# EAGLE design MAX2871 (EAGLE 9.3.1)
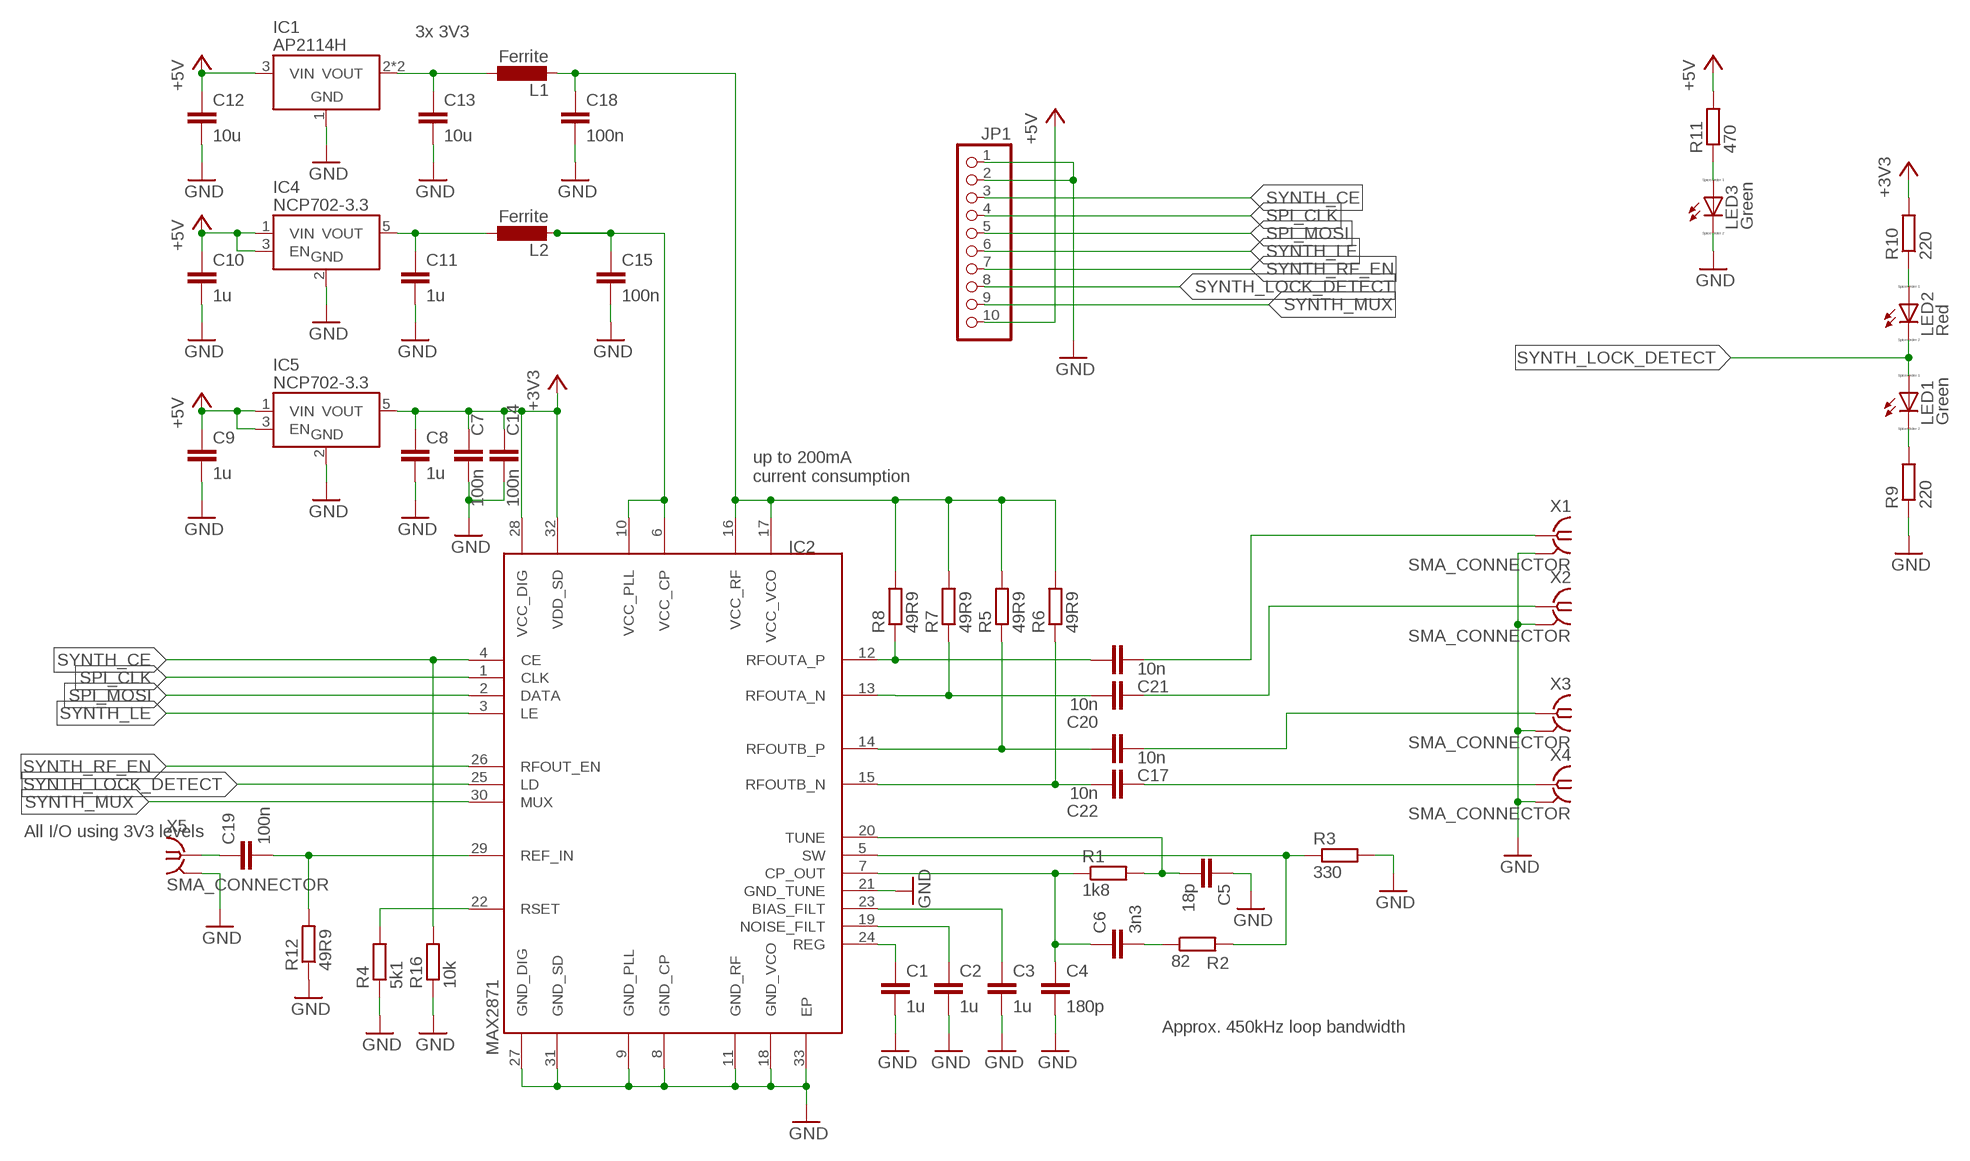
[diagram p0: schematic, sheet 1]

## Parts
C1  1u  C-EUC0603  [C0603]
C2  1u  C-EUC0603  [C0603]
C3  1u  C-EUC0603  [C0603]
C4  180p  C-EUC0603  [C0603]
C5  18p  C-EUC0603  [C0603]
C6  3n3  C-EUC0603  [C0603]
C7  100n  C-EUC0603  [C0603]
C8  1u  C-EUC0603  [C0603]
C9  1u  C-EUC0603  [C0603]
C10  1u  C-EUC0603  [C0603]
C11  1u  C-EUC0603  [C0603]
C12  10u  C-EUC1206  [C1206]
C13  10u  C-EUC1206  [C1206]
C14  100n  C-EUC0603  [C0603]
C15  100n  C-EUC0603  [C0603]
C17  10n  C-EUC0603  [C0603]
C18  100n  C-EUC0603  [C0603]
C19  100n  C-EUC0603  [C0603]
C20  10n  C-EUC0603  [C0603]
C21  10n  C-EUC0603  [C0603]
C22  10n  C-EUC0603  [C0603]
IC1  AP2114H  [SOT230P700X180-4]
IC2  MAX2871  [QFN50P500X500X80-33T310]
IC4  NCP702-3.3  NCP702  [SOT95P240X110-5]
IC5  NCP702-3.3  NCP702  [SOT95P240X110-5]
JP1  PINHD-1X10/90  [1X10/90]
L1  Ferrite  INDUCTOR0603  [R0603]
L2  Ferrite  INDUCTOR0603  [R0603]
LED1  Green  LED_ESML0603  [LED_SML0603]
LED2  Red  LED_ESML0603  [LED_SML0603]
LED3  Green  LED_ESML0603  [LED_SML0603]
R1  1k8  R-EU_R0603  [R0603]
R2  82  R-EU_R0603  [R0603]
R3  330  R-EU_R0603  [R0603]
R4  5k1  R-EU_R0603  [R0603]
R5  49R9  R-EU_R0603  [R0603]
R6  49R9  R-EU_R0603  [R0603]
R7  49R9  R-EU_R0603  [R0603]
R8  49R9  R-EU_R0603  [R0603]
R9  220  R-EU_R0603  [R0603]
R10  220  R-EU_R0603  [R0603]
R11  470  R-EU_R0603  [R0603]
R12  49R9  R-EU_R0603  [R0603]
R16  10k  R-EU_R0603  [R0603]
X1  SMA_CONNECTOR  [J502-ND-142-0711-821/826]
X2  SMA_CONNECTOR  [J502-ND-142-0711-821/826]
X3  SMA_CONNECTOR  [J502-ND-142-0711-821/826]
X4  SMA_CONNECTOR  [J502-ND-142-0711-821/826]
X5  SMA_CONNECTOR  [J502-ND-142-0711-821/826]

## Nets
10MHZ_REF: C19.1 X5.1
+3V3: C7.1 C8.1 C14.1 IC2.28(VCC_DIG) IC2.32(VDD_SD) IC5.5(VOUT) R10.2
+5V: C9.1 C10.1 C12.1 IC1.3(VIN) IC4.1(VIN) IC4.3(EN) IC5.1(VIN) IC5.3(EN) JP1.10 R11.2
GND: C1.2 C2.2 C3.2 C4.2 C5.1 C7.2 C8.2 C9.2 C10.2 C11.2 C12.2 C13.2 C14.2 C15.2 C18.2 IC1.1(GND) IC2.8(GND_CP) IC2.9(GND_PLL) IC2.11(GND_RF) IC2.18(GND_VCO) IC2.21(GND_TUNE) IC2.27(GND_DIG) IC2.31(GND_SD) IC2.33(EP) IC4.2(GND) IC5.2(GND) JP1.1 JP1.2 LED3.C R3.2 R4.1 R9.1 R12.1 R16.1 X1.G@1 X1.G@2 X1.G@3 X1.G@4 X2.G@1 X2.G@2 X2.G@3 X2.G@4 X3.G@1 X3.G@2 X3.G@3 X3.G@4 X4.G@1 X4.G@2 X4.G@3 X4.G@4 X5.G@1 X5.G@2 X5.G@3 X5.G@4
N$1: C5.2 IC2.20(TUNE) R1.2
N$2: C4.1 C6.1 IC2.7(CP_OUT) R1.1
N$3: C1.1 IC2.24(REG)
N$4: C2.1 IC2.19(NOISE_FILT)
N$5: C3.1 IC2.23(BIAS_FILT)
N$6: C6.2 R2.1
N$7: IC2.5(SW) R2.2 R3.1
N$8: IC2.22(RSET) R4.2
N$9: C19.2 IC2.29(REF_IN) R12.2
N$10: C18.1 IC2.16(VCC_RF) IC2.17(VCC_VCO) L1.2 R5.2 R6.2 R7.2 R8.2
N$11: C15.1 IC2.6(VCC_CP) IC2.10(VCC_PLL) L2.2
N$12: C22.2 IC2.15(RFOUTB_N) R6.1
N$13: LED3.A R11.1
N$14: C21.1 IC2.12(RFOUTA_P) R8.1
N$15: C20.2 IC2.13(RFOUTA_N) R7.1
N$16: C17.1 IC2.14(RFOUTB_P) R5.1
N$17: C21.2 X1.1
N$18: C20.1 X2.1
N$19: C17.2 X3.1
N$20: C22.1 X4.1
N$21: LED1.C R9.2
N$22: LED2.A R10.1
N$23: C13.1 IC1.2(VOUT) IC1.4(VOUT) L1.1
N$24: C11.1 IC4.5(VOUT) L2.1
SPI_CLK: IC2.1(CLK) JP1.4
SPI_MOSI: IC2.2(DATA) JP1.5
SYNTH_CE: IC2.4(CE) JP1.3 R16.2
SYNTH_LE: IC2.3(LE) JP1.6
SYNTH_LOCK_DETECT: IC2.25(LD) JP1.8 LED1.A LED2.C
SYNTH_MUX: IC2.30(MUX) JP1.9
SYNTH_RF_EN: IC2.26(RFOUT_EN) JP1.7

## Notes on the sheet
- 3x 3V3
- up to 200mA
  current consumption
- All I/O using 3V3 levels
- Approx. 450kHz loop bandwidth

## Library data of the parts
C1-C15 C17-C22 = rcl:C-EU: CAPACITOR, European symbol
IC1 = rf:AP2114
IC2 = rf:MAX2871
IC4 IC5 = rf:NCP702
JP1 = pinhead:PINHD-1X10: PIN HEADER
L1 L2 = rf:INDUCTOR
LED1-LED3 = eagle-ltspice:LED_E: LED Source: http://www.osram.convergy.de Source: www.luxeon.com Source: www.kingbright.com; SPICEMODEL: NONE; SPICEPREFIX: D; SPICETYPE: diode
R1-R12 R16 = resistor:R-EU_: RESISTOR, European symbol
X1-X5 = rf:SMA_CONNECTOR

## Board
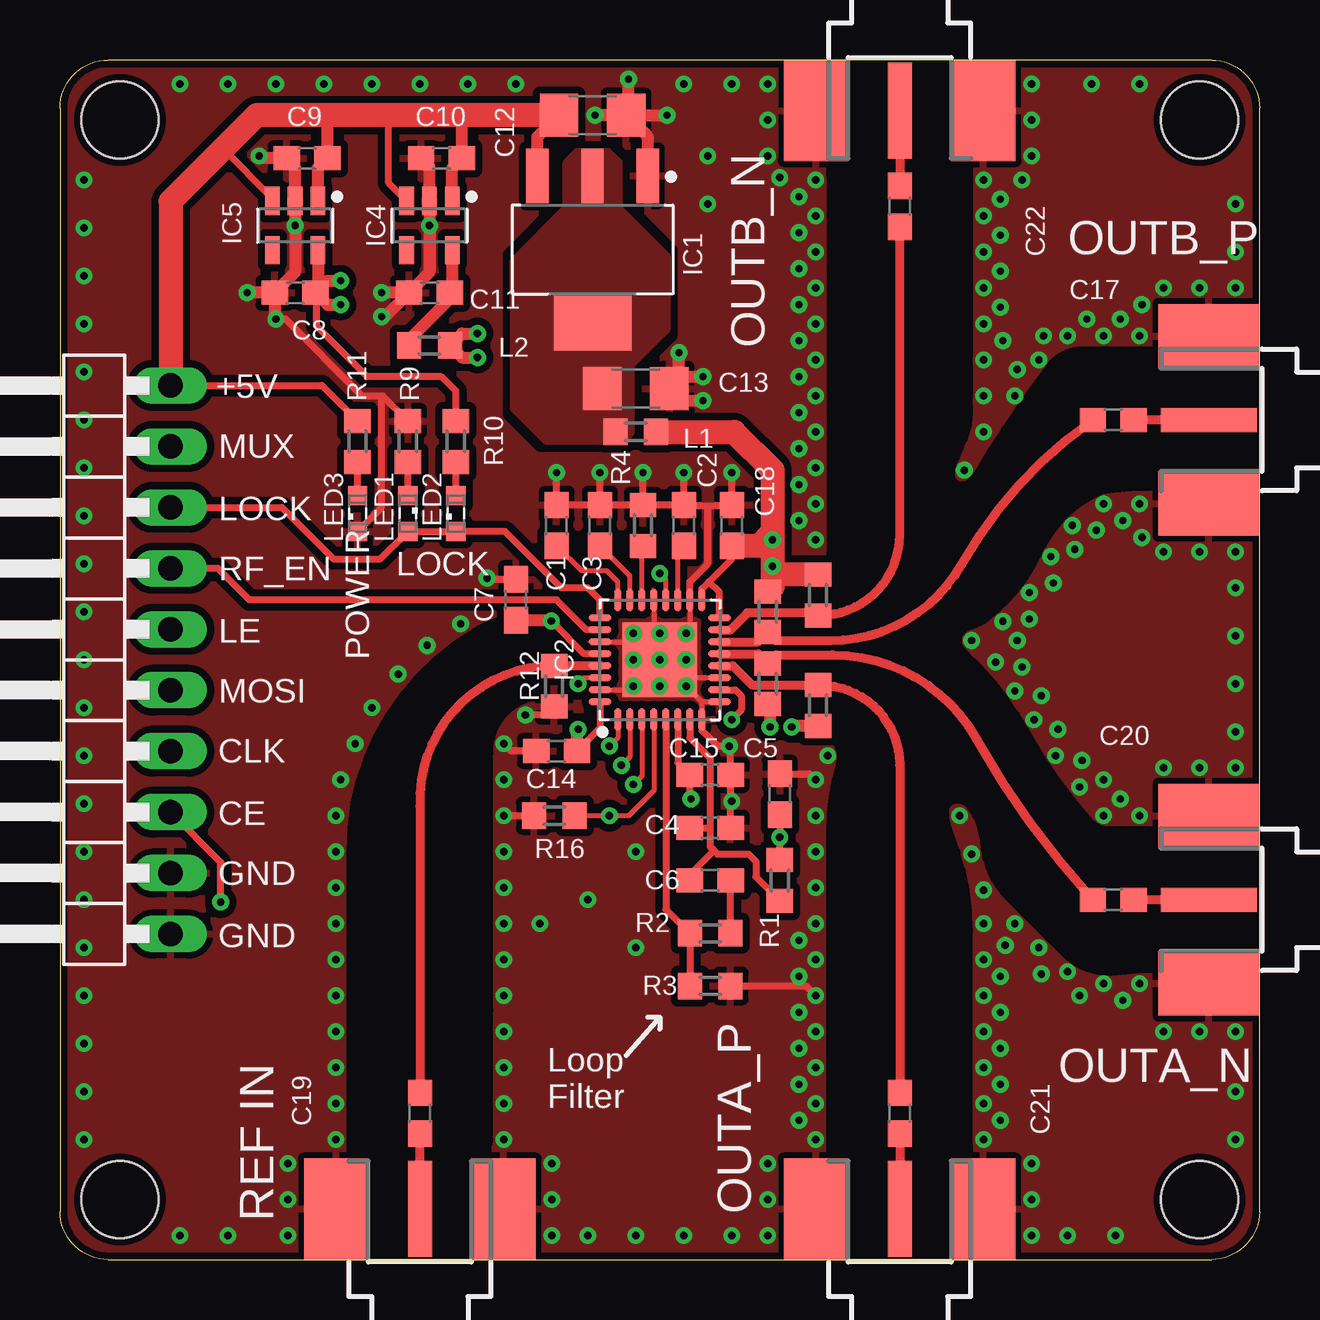
[diagram p1: board, top side]
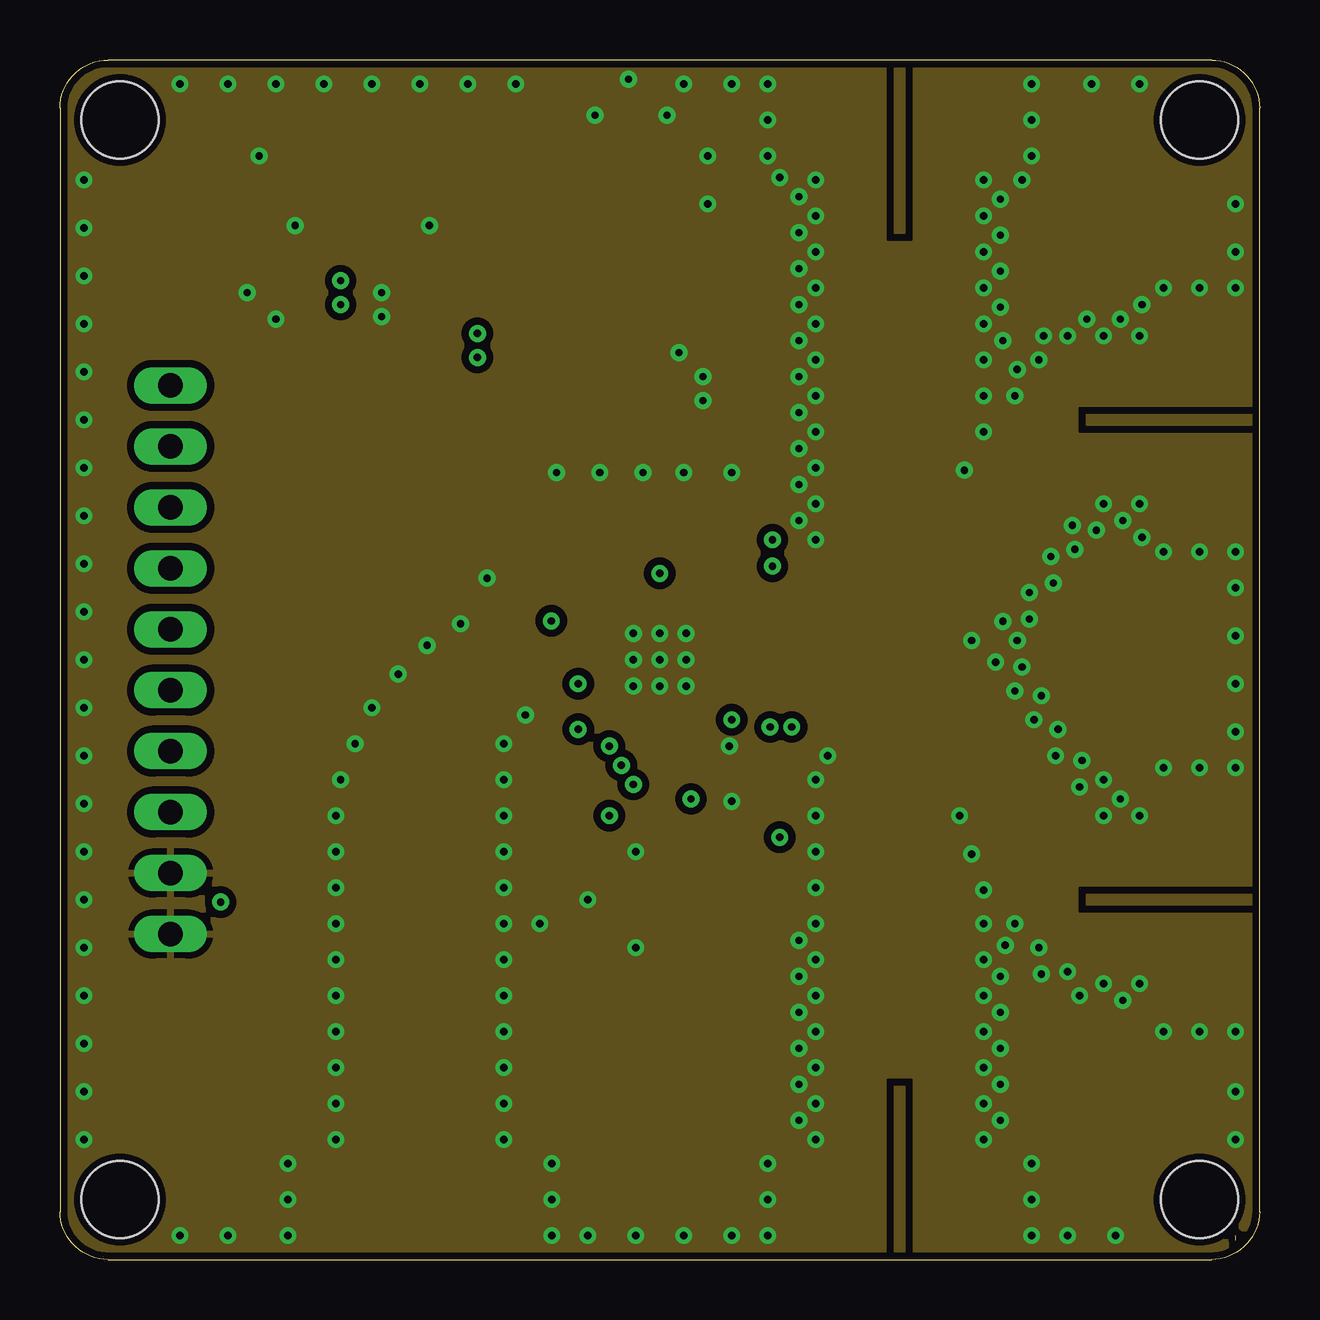
[diagram p2: board, inner layer Route2]
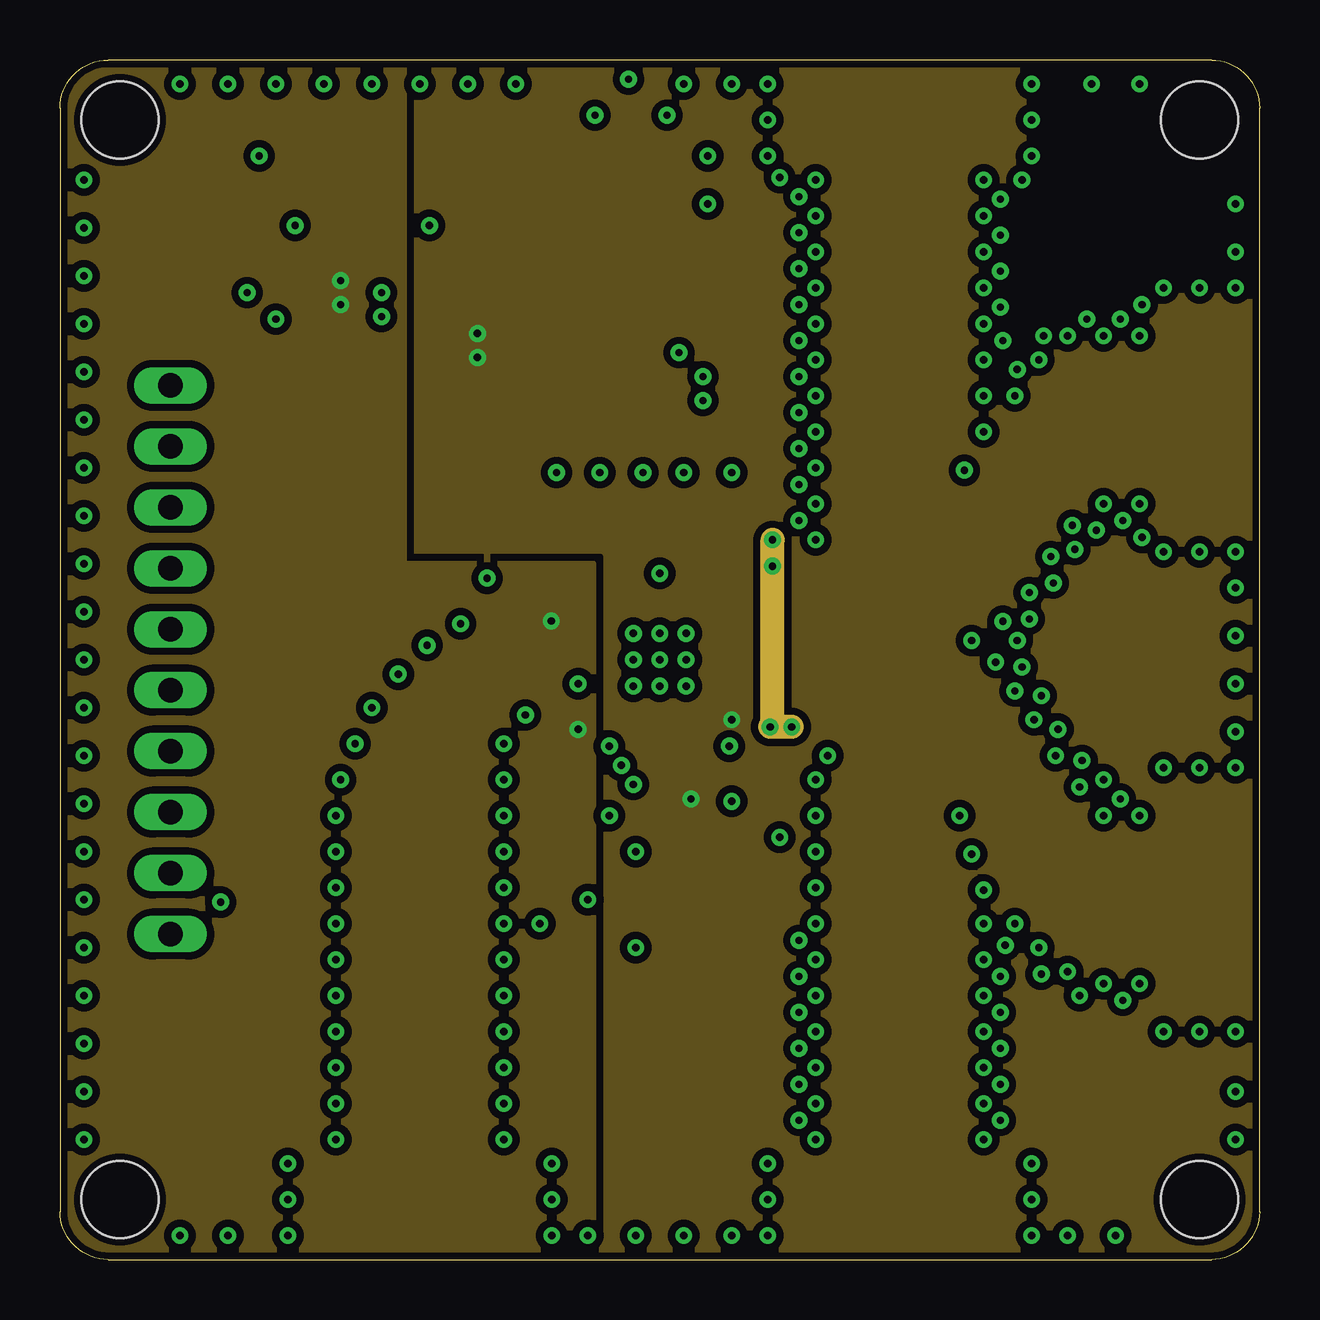
[diagram p3: board, inner layer Route15]
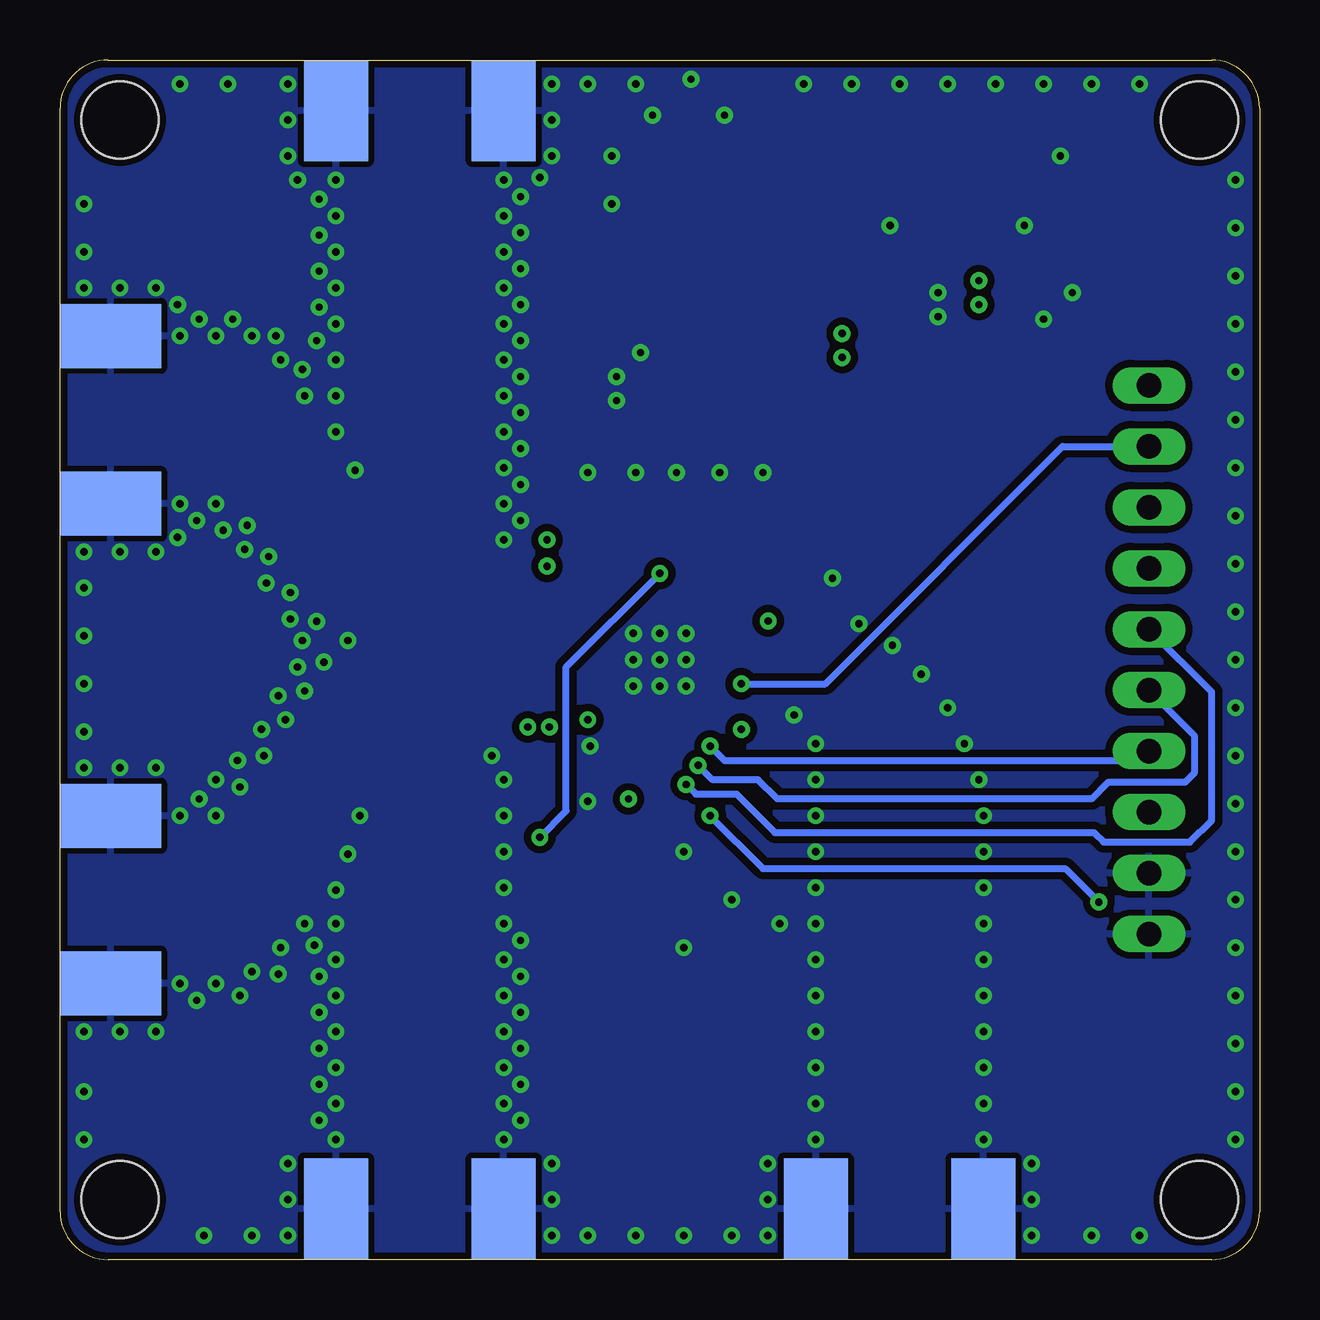
[diagram p4: board, bottom side, seen from below]

Size 50 x 50 mm. Coordinates in mm from the lower left corner, seen from the top.
Outline: 0,48 0,2 arc90 2,0 48,0 arc90 50,2 50,48 arc90 48,50 2,50 arc90 0,48
Copper layers (1+2*15+16): Top 0.035mm / dielectric 0.2mm / Route2 0.0175mm / dielectric 1.064mm / Route15 0.0175mm / dielectric 0.2mm / Bottom 0.035mm
Design rules "JLCPCB4L_7628 *": minimum track width 6mil, minimum drill 0.2mm, track to track 3.5mil, track to pad 3.5mil, pad to pad 3.5mil, via to via 3.5mil, smd to smd 0mil, copper to edge 0.2mm, drill to drill 0.2mm, minimum pad ring 10mil, minimum via ring 8mil, stop-mask expansion 4mil, vias tented up to drill 0mil, thermal gap 10mil
Holes 3.2 mm at 2.5,47.5 47.5,47.5 47.5,2.5 2.5,2.5
tRestrict: 86 lines

### Footprints (pad centres in the part's own frame; a part is rotated, then mirrored left to right if it is on the bottom)
C0603 = smd 1.1 x 1: 1 -0.85,0; 2 0.85,0
C1206 = smd 1.6 x 1.8: 1 -1.4,0; 2 1.4,0
SOT230P700X180-4 = smd 2.265 x 0.929: 1 -3.073,2.3; 2 -3.073,0; 3 -3.073,-2.3 | smd 2.265 x 3.229: 4 3.073,0
QFN50P500X500X80-33T310 = smd 0.937 x 0.27: 1 -2.487,1.75; 2 -2.487,1.25; 3 -2.487,0.75; 4 -2.487,0.25; 5 -2.487,-0.25; 6 -2.487,-0.75; 7 -2.487,-1.25; 8 -2.487,-1.75; 17 2.487,-1.75; 18 2.487,-1.25; 19 2.487,-0.75; 20 2.487,-0.25; 21 2.487,0.25; 22 2.487,0.75; 23 2.487,1.25; 24 2.487,1.75 | smd 0.27 x 0.937: 9 -1.75,-2.487; 10 -1.25,-2.487; 11 -0.75,-2.487; 12 -0.25,-2.487; 13 0.25,-2.487; 14 0.75,-2.487; 15 1.25,-2.487; 16 1.75,-2.487; 25 1.75,2.487; 26 1.25,2.487; 27 0.75,2.487; 28 0.25,2.487; 29 -0.25,2.487; 30 -0.75,2.487; 31 -1.25,2.487; 32 -1.75,2.487 | smd 3.1 x 3.1: 33 0,0
SOT95P240X110-5 = smd 1.18 x 0.609: 1 -1.024,0.95; 2 -1.024,0; 3 -1.024,-0.95; 4 1.024,-0.95; 5 1.024,0.95
1X10/90 = drill 1.016 long: 1 -11.43,-3.81; 2 -8.89,-3.81; 3 -6.35,-3.81; 4 -3.81,-3.81; 5 -1.27,-3.81; 6 1.27,-3.81; 7 3.81,-3.81; 8 6.35,-3.81; 9 8.89,-3.81; 10 11.43,-3.81
R0603 = smd 1 x 1.1: 1 -0.85,0; 2 0.85,0
LED_SML0603 = smd 0.8 x 0.8: A 0.75,0; C -0.75,0
J502-ND-142-0711-821/826 = smd 4 x 1: 1 2.115,0 | smd 4.191 x 2.667: G@1 2.115,3.495; G@2 2.115,-3.495 | smd 4.191 x 2.667 bottom: G@3 2.115,3.495; G@4 2.115,-3.495

### Placement (x,y rotation side)
C1  20.7,30.6 90 top
C2  26,30.6 90 top
C3  22.5,30.6 90 top
C4  27.1,18 0 top
C5  30,19.4 270 top
C6  27.1,15.8 0 top
C7  19,27.5 90 top
C8  9.8,40.3 180 top
C9  10.3,45.9 180 top
C10  15.9,45.9 180 top
C11  15.4,40.3 180 top
C12  22.2,47.7 0 top
C13  24,36.3 0 top
C14  20.7,21.2 180 top
C15  27.1,20.2 0 top
C17  43.9,35 0 top
C18  28,30.6 90 top
C19  15,6.1 90 top
C20  43.9,15 180 top
C21  35,6.1 270 top
C22  35,43.9 270 top
IC1  22.2,42.1 270 top
IC2  25,25 90 top
IC4  15.4,43.1 270 top
IC5  9.8,43.1 270 top
JP1  0.8,25 90 top
L1  24,34.5 0 top
L2  15.4,38.1 0 top
LED1  14.5,31.1 270 top
LED2  16.5,31.1 90 top
LED3  12.4,31.1 90 top
R1  30,15.8 90 top
R2  27.1,13.6 180 top
R3  27.1,11.4 0 top
R4  24.3,30.6 270 top
R5  29.5,27 90 top
R6  31.6,27.7 90 top
R7  29.5,24 270 top
R8  31.6,23.1 270 top
R9  14.5,34.1 270 top
R10  16.5,34.1 90 top
R11  12.4,34.1 90 top
R12  20.6,23.9 90 top
R16  20.6,18.5 0 top
X1  35,0 90 top
X2  50,15 180 top
X3  50,35 180 top
X4  35,50 270 top
X5  15,0 90 top

### Tracks (layer width: path | path; a pad name or v marks a point on that pad's centre or on a via)
10MHZ_REF
  Top 0.37: X5.1 C19.1
+3V3  (via drill 0.3 pad 0.6)
  Top 0.3: R10.2 16.5,36.2 15.9,36.8 12.8,36.8 10.7,38.9 10.7,40.35 10.75,40.4 | IC2.28 21.85,25.25 20.5,26.6 v20.48,26.62 20.45,26.65 | IC2.32 22.51,22.16 C14.1
  Top 0.5: IC5.5 10.75,40.4 C8.1 | C14.1 21.55,22.05 v21.6,22.1 | C7.1 20.45,26.65 20.5,26.6 | C8.1 11.15,40.8 v11.7,40.8 | C8.1 11.15,39.8 v11.7,39.8
  pour Route15 (isolate 0.3): -3,52.1 14.3,52.1 14.3,37.6 14.3,29 20.6,29 22.2,29 22.2,-3.5 -3,-3.5
+5V
  Top 0.3: IC4.3 13.7,44.87 13.7,47.7 | IC5.3 8.85,44.25 6.8,46.3 | JP1.10 10.92,36.43 R11.2
  Top 0.5: IC1.3 19.9,46.8 C12.1 | IC5.1 10.75,45.5 C9.1 11.15,47.65 11.1,47.7 | IC4.1 16.35,45.5 C10.1 16.75,47.65 16.8,47.7
  Top 1: C12.1 16.8,47.7 14.3,47.7 13.7,47.7 11.1,47.7 8.9,47.7 8.2,47.7 6.8,46.3 4.61,44.11 JP1.10
DUMMY
  Route2 0: 49,0.8 49,1
  pour Route2 (isolate 0.3, rank 2): 50,15.2 42.8,15.2 42.8,14.8 50,14.8
  pour Route2 (isolate 0.3, rank 2): 50,35.2 42.8,35.2 42.8,34.8 50,34.8
  pour Route2 (isolate 0.3, rank 2): 34.8,50 34.8,42.8 35.2,42.8 35.2,50
  pour Route2 (isolate 0.3, rank 2): 35.2,0 35.2,7.2 34.8,7.2 34.8,0
GND  (via drill 0.3 pad 0.6)
  Top 0.2: IC2.21 24.75,25.25 24.85,25.15 | 24.85,25.15 IC2.33 | IC2.27 24.25,25.75 24.85,25.15 | IC2.31 23.75,23.75 IC2.33 | IC2.11 25.75,24.25 25.2,24.8 | 25.2,24.8 25.1,24.9 | 25.1,24.9 IC2.33 | IC2.9 26.75,23.25 | 26.75,23.25 25.2,24.8 | 25.2,24.8 25.1,24.9 | 25.1,24.9 IC2.33 | IC2.8 26.75,23.25 | 26.75,23.25 25.2,24.8 | IC2.18 26.25,26.05 25.1,24.9
  Top 0.3: R9.1 13.45,36 13.4,36 | 13.4,36 12.6,36 9.4,39.2 8.95,39.2 | LED3.C 13.4,31.35 13.4,36 | IC2.8 26.75,22.05 27.4,21.4 v27.9,21.4 27.95,21.35 C15.2 27.95,19.05 | C4.2 27.95,19.05 | 27.95,19.05 v28,19.1 | IC2.18 26.25,28.25 27,29 27,31.4 | 27,31.4 26.05,31.4 C2.2 | 27,31.4 27.95,31.4 C18.2 v28,32.8 | C7.2 17.85,28.35 v17.8,28.4 | C14.2 18.8,21.2 v18.5,21.5 | R16.1 v18.5,18.5 | R12.1 20.25,22.7 v19.4,22.7 | C5.1 31.25,20.25 v31.5,20 | R3.2 31.1,11.4 v31.5,11 | C2.2 R4.1 | R4.1 C3.2 | C3.2 C1.2 v20.7,32.8 | C2.2 v26,32.8 | R4.1 v24.3,32.8 | C3.2 v22.5,32.8
  Top 0.5: IC1.1 24.5,46.8 C12.2 | C10.2 15.4,45.55 IC4.2 15.4,41.15 C11.2 | C8.2 9.8,41.15 IC5.2 9.8,45.55 C9.2 8.3,45.9 v8.3,46 | C8.2 8.95,39.2 v9,39.2 | C12.2 v25.3,47.7 | C12.2 v22.3,47.7 | C12.2 23.7,47.7 v23.7,49.2 | C13.2 25.4,35.8 v26.8,35.8 | C13.2 25.4,36.8 v26.8,36.8 | C13.2 25.8,36.3 v25.8,37.8 | C8.2 v7.8,40.3 | C11.2 v13.4,40.3 | C11.2 13.55,39.3 v13.4,39.3
  other vias: 9.8,43.1 15.4,43.1 11.5,5 11.5,6.5 11.5,8 11.5,9.5 11.5,11 11.5,12.5 11.5,14 11.5,15.5 11.5,18.5 11.7,20 12.3,21.5 13,23 14.1,24.4 15.3,25.6 18.5,5 18.5,6.5 18.5,8 18.5,9.5 18.5,11 18.5,12.5 18.5,14 18.5,15.5 18.5,17 18.5,20 11.5,17 16.7,26.5 31.5,5 31.5,6.5 31.5,8 31.5,9.5 31.5,12.5 31.5,14 31.5,15.5 31.5,17 31.5,18.5 32,21 38.5,5 38.5,6.5 38.5,8 38.5,9.5 38.5,11 38.5,12.5 38.5,14 38.5,15.4 38,16.9 37.5,18.5 45,11.5 43.5,11.5 42,12 40.8,13 39.8,14 31.5,45 31.5,43.5 31.5,42 31.5,40.5 31.5,39 31.5,37.5 31.5,36 31.5,34.5 31.5,33 31.5,31.5 31.5,30 38.5,45 38.5,43.5 38.5,42 38.5,40.5 38.5,39 38.5,37.5 38.5,36 38.5,34.5 37.7,32.9 45,38.5 43.5,38.5 42,38.5 40.8,37.5 39.8,36 45,31.5 43.5,31.5 42.2,30.6 41.3,29.3 40.4,27.8 39.3,26.6 38,25.8 45,18.5 43.5,18.5 42.5,19.7 41.5,21 40.6,22.5 39.8,23.7 39,24.9 49,40.5 47.5,40.5 46,40.5 40.5,49 40.5,47.5 40.5,46 29.5,49 29.5,47.5 29.5,46 49,20.5 47.5,20.5 46,20.5 49,9.5 47.5,9.5 46,9.5 40.5,1 40.5,2.5 40.5,4 29.5,1 29.5,2.5 29.5,4 20.5,1 20.5,2.5 20.5,4 9.5,1 9.5,2.5 9.5,4 23.9,26.1 26.1,26.1 26.1,23.9 23.9,23.9 25,23.9 25,25 26.1,25 25,26.1 23.9,25 30.8,32.3 30.8,30.8 30.8,33.8 30.8,35.3 30.8,36.8 30.8,38.3 30.8,39.8 30.8,41.3 30.8,42.8 30.8,44.3 30,45.1 30.8,5.8 30.8,7.3 30.8,8.8 30.8,10.3 30.8,11.8 30.8,13.3 39.2,5.8 39.2,7.3 39.2,8.8 39.2,10.3 39.2,11.8 39.4,13.1 40.9,11.9 42.5,11 44.3,10.8 44.2,19.2 43.5,20 42.6,20.8 41.6,22.1 40.9,23.5 40.1,24.7 40.4,26.7 39.9,25.8 41.4,28.2 42.3,29.6 43.2,30.4 44.3,30.8 44.2,39.2 42.8,39.2 41,38.5 39.9,37.1 39.3,38.3 39.2,39.7 39.2,41.2 39.2,42.7 39.2,44.2 40.1,45 45.1,39.8 49,29.5 47.5,29.5 46,29.5 45.1,30.1 7,1 5,1 1,5 1,7 1,9 1,11 1,13 1,15 1,17 1,19 1,21 1,23 1,25 1,27 1,29 1,31 1,33 1,35 1,37 1,39 1,41 1,43 1,45 5,49 7,49 9,49 11,49 13,49 15,49 17,49 19,49 28,49 26,49 22,1 24,1 26,1 28,1 42,1 44,1 49,5 49,7 49,22 49,24 49,26 49,28 49,42 49,44 45,49 43,49 27,44 27,46 24,17 22,15 20,14 24,13
  pour Route2 (isolate 0.3, rank 6): -2.3,51.9 52.3,51.9 52.3,-1.9 -2.3,-1.9
  pour Top (isolate 0.3, rank 2): -4.4,53.7 54.7,53.7 54.7,-5.1 -4.4,-5.1
  pour Bottom (isolate 0.3, rank 2): -1.1,52.3 -1.1,-3.7 53.2,-3.7 53.2,52.3
N$1  (via drill 0.3, 0.3 pad 0.6)
  Top 0.2: IC2.20 25.25,28.35 v25,28.6
  Top 0.3: R1.2 v30,17.6 C5.2
  Bottom 0.3: v30,17.6 28.9,18.7 28.9,24.7 v25,28.6
N$2
  Top 0.3: IC2.7 26.25,21.75 27.1,20.9 27.1,18 | 27.1,18 27.1,17.2 27.25,17.05 | 27.25,17.05 27.4,16.9 28.7,16.9 29,16.6 29,15.95 R1.1 | C4.1 27.1,18 | C6.1 26.25,16.05 27.25,17.05
N$3
  Top 0.2: IC2.24 23.25,28.25 22.8,28.7 21.75,28.7 C1.1
N$4
  Top 0.2: IC2.19 25.75,29.5 C2.1
N$5
  Top 0.2: IC2.23 23.75,28.5 C3.1
N$6
  Top 0.3: R2.1 C6.2
N$7
  Top 0.3: IC2.5 25.25,14.6 R2.2 R3.1
N$8
  Top 0.2: IC2.22 24.25,29.7 R4.2
N$9
  Top 0.37: IC2.29 R12.2 arc93 15,18.9 C19.2
N$10  (via drill 0.3 pad 0.6)
  Top 0.3: IC2.17 26.75,27.95 27.05,28.25 | C18.1 28,29.2 27.05,28.25 | IC2.16 27.49,27.81 27.05,28.25
  Top 0.5: R8.2 30.55,22.25 | 30.55,22.25 v30.5,22.2 30.55,22.25 | R7.2 29.6,23.05 v29.6,22.2 | v29.7,30 29.7,30.3 | v29.7,28.9 29.7,28.7 29.85,28.55
  Top 1: L1.2 28.1,34.5 29.7,32.9 29.7,30.3 | C18.1 29.15,29.75 29.7,30.3 | 29.7,30.3 29.7,28.7 | 29.7,28.7 29.7,28.05 R5.2 | R6.2 29.85,28.55 29.7,28.7
  Route15 1: v30.5,22.2 v29.6,22.2 29.7,22.3 v29.7,30
N$11  (via drill 0.3 pad 0.6)
  Top 0.3: IC2.6 25.75,20.7 C15.1 26.25,19.25 v26.3,19.2 | IC2.10 28.15,23.75 28.4,23.5 28.4,22.9 v28,22.5
  Top 0.5: v17.4,38.6 16.75,38.6 L2.2 16.75,37.6 v17.4,37.6
  pour Route15 (isolate 0.3, rank 2): 11.8,53 55.5,53 55.5,-5 11.8,-5
N$12
  Top 0.37: IC2.15 27.95,26.25 28.65,26.95 31.5,26.95 R6.1 31.65,26.85 arc90 35,30.2 C22.2
N$13
  Top 0.3: LED3.A R11.1
N$14
  Top 0.37: IC2.12 28.05,24.75 28.85,23.95 R8.1 31.65,23.95 arc-90 35,20.6 C21.1
N$15
  Top 0.37: IC2.13 29.1,25.25 R7.1 29.85,25.2 32.2,25.2 arc-61 38.2,21.7 arc13 C20.2
N$16
  Top 0.37: IC2.14 29.1,25.75 R5.1 29.85,25.8 32.1,25.8 arc60 37.6,29 arc-25 C17.1
N$17
  Top 0.37: C21.2 X1.1
N$18
  Top 0.37: X2.1 C20.1
N$19
  Top 0.37: X3.1 C17.2
N$20
  Top 0.37: X4.1 C22.1
N$21
  Top 0.3: LED1.C R9.2
N$22
  Top 0.3: LED2.A R10.1
N$23
  pour Top (no thermals): 21.6,46.1 22.8,46.1 23.2,45.7 23.2,43.8 25.2,41.8 25.2,38.8 23.7,37.3 23.7,34.5 23.4,34.2 20.3,34.2 19,35.5 19,41.6 21.2,43.8 21.2,45.7
N$24
  Top 0.5: IC4.5 16.35,40.4 C11.1 16.25,40.05 14.55,38.35 L2.1
SPI_CLK  (via drill 0.3 pad 0.6)
  Top 0.2: IC2.1 23.25,21.75 v22.9,21.4
  Bottom 0.3: v22.9,21.4 22.3,20.8 5,20.8 JP1.4
SPI_MOSI  (via drill 0.3 pad 0.6)
  Top 0.2: IC2.2 23.75,20.95 v23.4,20.6
  Bottom 0.3: JP1.5 2.7,21.82 2.7,20.3 3.1,19.9 6.3,19.9 7,19.2 20.1,19.2 20.9,20 22.8,20 v23.4,20.6
SYNTH_CE  (via drill 0.3 pad 0.6)
  Top 0.2: IC2.4 24.75,19.55 23.7,18.5 v22.9,18.5 R16.2
  Top 0.3: v6.7,14.9 6.7,16.56 JP1.3
  Bottom 0.3: v22.9,18.5 20.7,16.3 8.1,16.3 v6.7,14.9
SYNTH_LE  (via drill 0.3 pad 0.6)
  Top 0.2: IC2.3 24.25,20.15 v23.9,19.8
  Bottom 0.3: v23.9,19.8 23.5,19.4 21.8,19.4 20.2,17.8 6.9,17.8 6.5,17.4 2.9,17.4 2,18.3 2,23.66 JP1.6
SYNTH_LOCK_DETECT
  Top 0.3: JP1.8 9.25,31.35 11.4,29.2 13.35,29.2 LED1.A LED2.C 18.55,30.35 20.9,28 22,28 22.51,27.49 IC2.25
SYNTH_MUX  (via drill 0.3)
  Top 0.2: IC2.30 21.85,24.25 v21.6,24
  Bottom 0.3: v21.6,24 18.1,24 8.21,33.89 JP1.9
SYNTH_RF_EN
  Top 0.3: IC2.26 21.95,26.25 20.7,27.5 7.9,27.5 6.59,28.81 JP1.7

### Text on the board
tPlace: OUTB_P | OUTB_N | +5V | MUX | LOCK | RF_EN | LOCK | LE | POWER | MOSI | CLK | CE | GND | GND | OUTA_N | Loop / Filter | REF IN | OUTA_P
bStop: 04/2020 | github.com/jankae/VNA | MAX2871 PLL / Synthesizer